# EAGLE design uhf.indication.v2 (EAGLE 6.5.0)
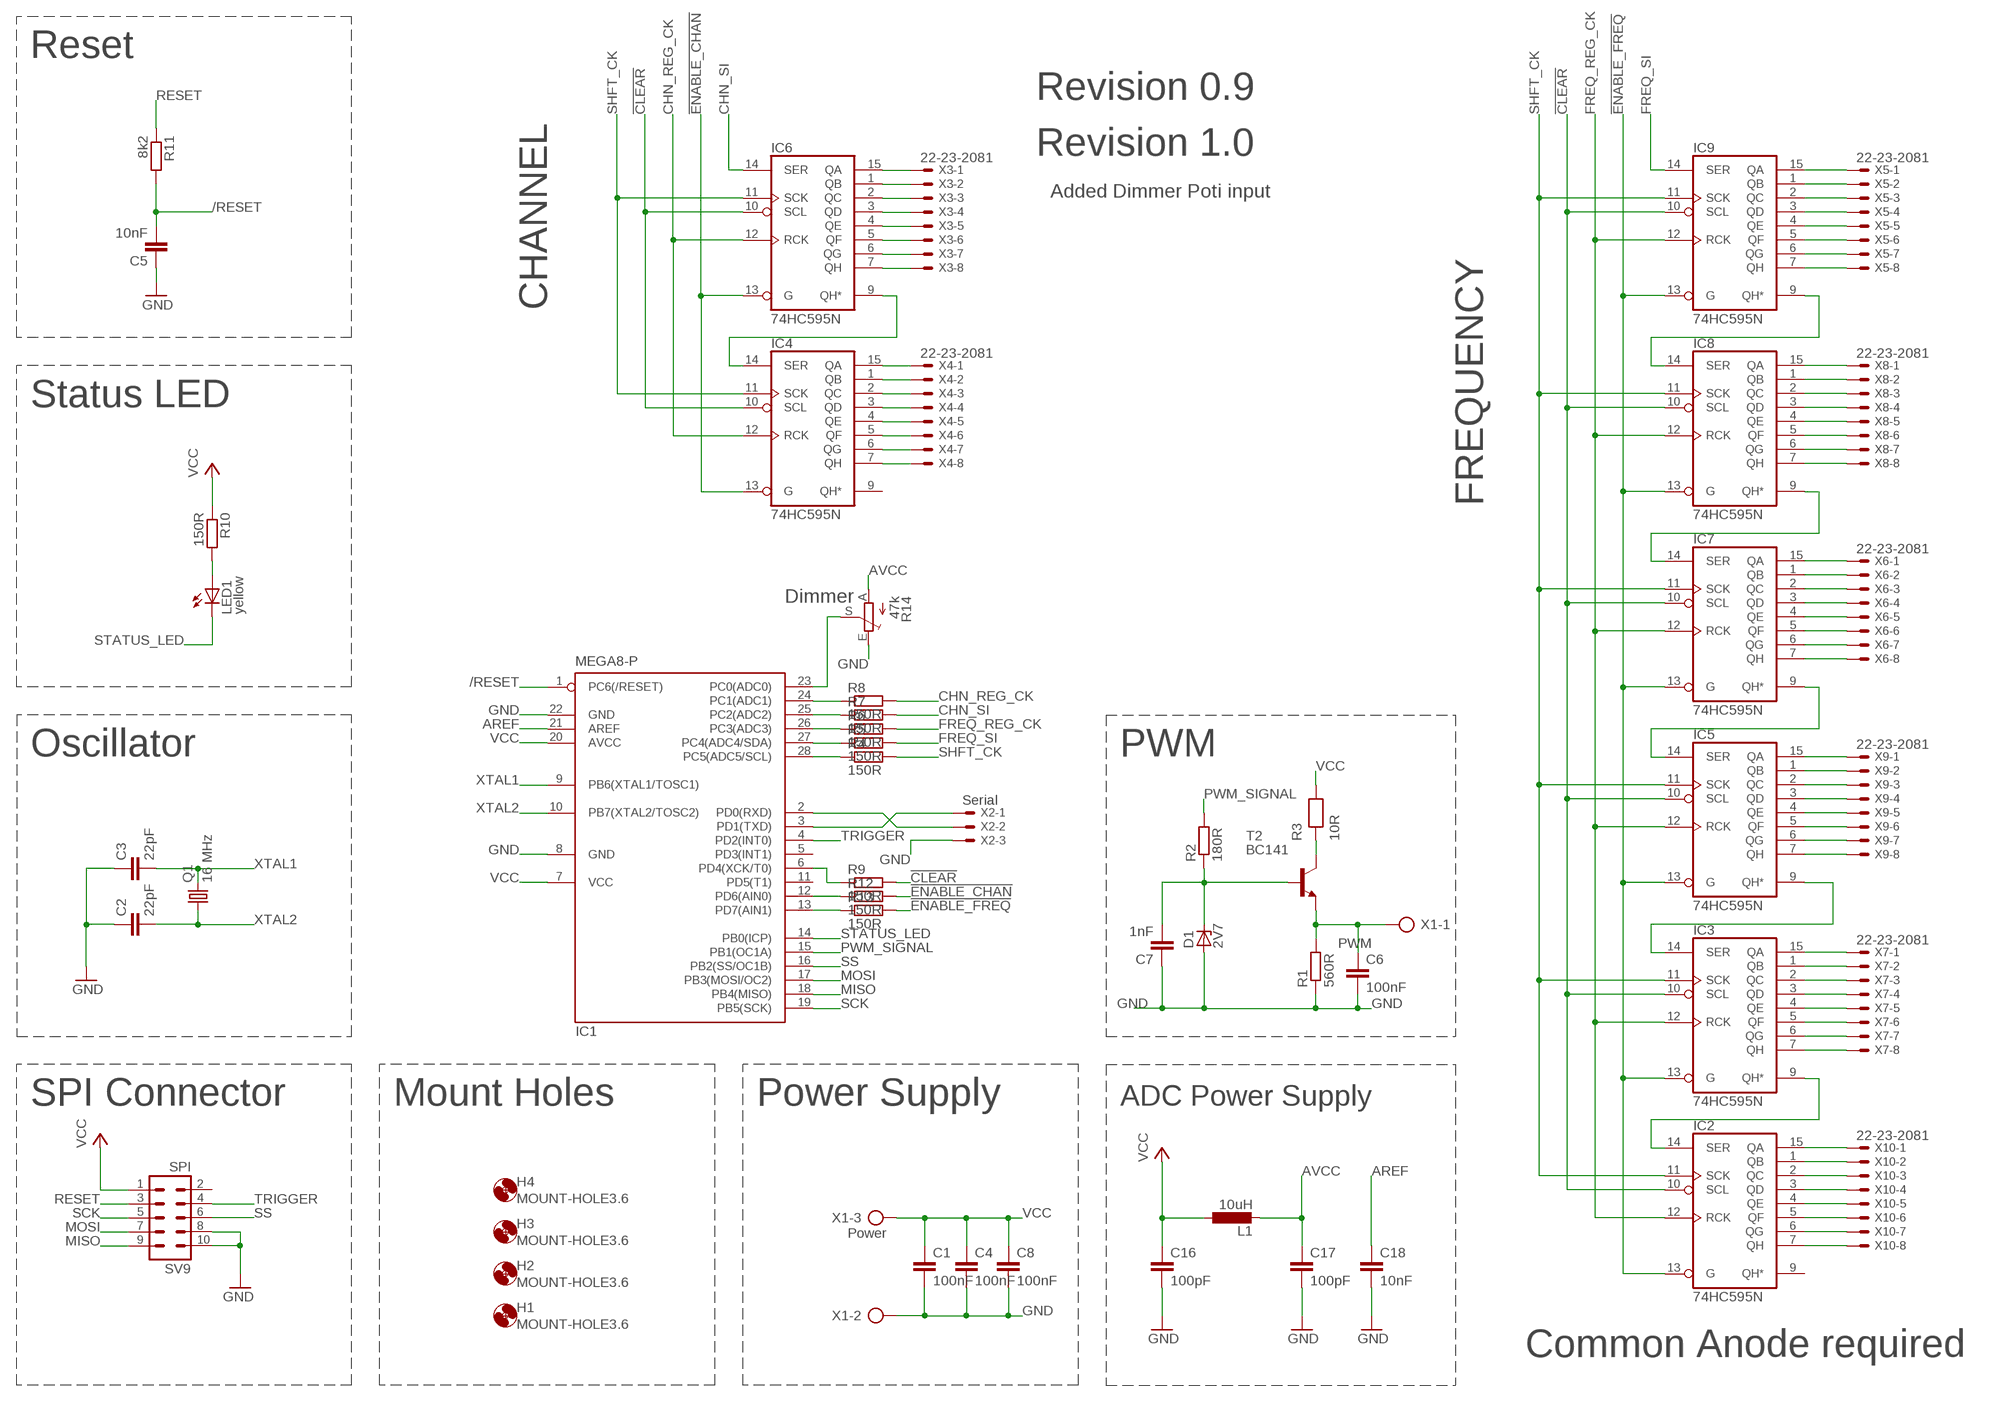
[diagram p0: schematic, sheet 1]

## Parts
C1  100nF  C-EU050-024X044  [C050-024X044]
C2  22pF  C-EU025-025X050  [C025-025X050]
C3  22pF  C-EU025-025X050  [C025-025X050]
C4  100nF  C-EU050-024X044  [C050-024X044]
C5  10nF  C-EU025-025X050  [C025-025X050]
C6  100nF  C-EU050-024X044  [C050-024X044]
C7  1nF  C-EU025-025X050  [C025-025X050]
C8  100nF  C-EU050-024X044  [C050-024X044]
C16  100pF  C-EU025-025X050  [C025-025X050]
C17  100pF  C-EU025-025X050  [C025-025X050]
C18  10nF  C-EU025-025X050  [C025-025X050]
D1  2V7  ZENER-DIODEZD-10  [ZDIO-10]
H1  MOUNT-HOLE3.6  [3,6]
H2  MOUNT-HOLE3.6  [3,6]
H3  MOUNT-HOLE3.6  [3,6]
H4  MOUNT-HOLE3.6  [3,6]
IC1  MEGA8-P  [DIL28-3]
IC2  74HC595N  [DIL16]
IC3  74HC595N  [DIL16]
IC4  74HC595N  [DIL16]
IC5  74HC595N  [DIL16]
IC6  74HC595N  [DIL16]
IC7  74HC595N  [DIL16]
IC8  74HC595N  [DIL16]
IC9  74HC595N  [DIL16]
L1  10uH  L-EU2200-15.24  [2200-15.24]
LED1  yellow  LEDCHIPLED_1206  [CHIPLED_1206]
Q1  16 MHz  CRYSTALHC18U-V  [HC18U-V]
R1  560R  R-EU_0207/2V  [0207/2V@1]
R2  180R  R-EU_0207/2V  [0207/2V@1]
R3  10R  RESISTOR  [208-08]
R4  150R  R-EU_R0805  [R0805]
R5  150R  R-EU_R0805  [R0805]
R6  150R  R-EU_R0805  [R0805]
R7  150R  R-EU_R0805  [R0805]
R8  150R  R-EU_R0805  [R0805]
R9  150R  R-EU_R0805  [R0805]
R10  150R  R-EU_R0805  [R0805]
R11  8k2  R-EU_M0805  [M0805]
R12  150R  R-EU_R0805  [R0805]
R13  150R  R-EU_R0805  [R0805]
R14  47k  TRIM_EU-B25V  [B25V]
SV9  SPI  ML10  [ML10]
T2  BC141  BC141-16-NPN-TO39-EBC  [TO39]
X1  Power  AK500/3  [AK500/3]
X2  Serial  22-23-2031  [22-23-2031]
X3  22-23-2081  [22-23-2081]
X4  22-23-2081  [22-23-2081]
X5  22-23-2081  [22-23-2081]
X6  22-23-2081  [22-23-2081]
X7  22-23-2081  [22-23-2081]
X8  22-23-2081  [22-23-2081]
X9  22-23-2081  [22-23-2081]
X10  22-23-2081  [22-23-2081]

## Nets
!CLEAR: IC2.10(SCL) IC3.10(SCL) IC4.10(SCL) IC5.10(SCL) IC6.10(SCL) IC7.10(SCL) IC8.10(SCL) IC9.10(SCL) R9.2
!ENABLE_CHAN: IC4.13(G) IC6.13(G) R12.2
!ENABLE_FREQ: IC2.13(G) IC3.13(G) IC5.13(G) IC7.13(G) IC8.13(G) IC9.13(G) R13.2
/RESET: C5.2 IC1.1(PC6(/RESET)) R11.2
AREF: C18.1 IC1.21(AREF)
AVCC: C17.1 L1.2 R14.A
CHN_REG_CK: IC4.12(RCK) IC6.12(RCK) R8.2
CHN_SI: IC6.14(SER) R7.2
FREQ_REG_CK: IC2.12(RCK) IC3.12(RCK) IC5.12(RCK) IC7.12(RCK) IC8.12(RCK) IC9.12(RCK) R6.2
FREQ_SI: IC9.14(SER) R5.2
GND: C1.2 C2.1 C3.1 C4.2 C5.1 C6.2 C7.1 C8.2 C16.2 C17.2 C18.2 D1.A IC1.8(GND) IC1.22(GND) R1.1 R14.E SV9.8 SV9.10 X1.2 X2.3
MISO: IC1.18(PB4(MISO)) SV9.9
MOSI: IC1.17(PB3(MOSI/OC2)) SV9.7
N$1: IC1.28(PC5(ADC5/SCL)) R4.1
N$2: IC1.6(PD4(XCK/T0)) R9.1
N$3: IC4.14(SER) IC6.9(QH*)
N$4: IC6.15(QA) X3.1
N$5: IC1.24(PC1(ADC1)) R8.1
N$6: IC1.25(PC2(ADC2)) R7.1
N$7: IC8.14(SER) IC9.9(QH*)
N$8: IC7.14(SER) IC8.9(QH*)
N$9: IC5.14(SER) IC7.9(QH*)
N$10: IC3.14(SER) IC5.9(QH*)
N$11: IC2.14(SER) IC3.9(QH*)
N$12: IC6.1(QB) X3.2
N$13: IC6.2(QC) X3.3
N$14: IC6.3(QD) X3.4
N$15: IC6.4(QE) X3.5
N$16: IC6.5(QF) X3.6
N$17: IC6.6(QG) X3.7
N$18: IC6.7(QH) X3.8
N$19: IC4.15(QA) X4.1
N$20: IC4.1(QB) X4.2
N$21: IC4.2(QC) X4.3
N$22: IC4.3(QD) X4.4
N$23: IC4.4(QE) X4.5
N$24: IC4.5(QF) X4.6
N$25: IC4.6(QG) X4.7
N$26: IC4.7(QH) X4.8
N$27: IC9.15(QA) X5.1
N$28: IC9.1(QB) X5.2
N$29: IC9.2(QC) X5.3
N$30: IC9.3(QD) X5.4
N$31: IC9.4(QE) X5.5
N$32: IC1.26(PC3(ADC3)) R6.1
N$33: IC1.27(PC4(ADC4/SDA)) R5.1
N$35: IC9.5(QF) X5.6
N$36: IC9.6(QG) X5.7
N$37: C7.2 D1.C R2.1 T2.2(B)
N$38: R3.P$2 T2.3(C)
N$39: IC1.13(PD7(AIN1)) R13.1
N$40: IC1.12(PD6(AIN0)) R12.1
N$41: IC1.23(PC0(ADC0)) R14.S
N$45: IC9.7(QH) X5.8
N$46: IC8.15(QA) X8.1
N$47: LED1.A R10.2
N$48: IC8.1(QB) X8.2
N$49: IC8.2(QC) X8.3
N$50: IC8.3(QD) X8.4
N$51: IC8.4(QE) X8.5
N$52: IC8.5(QF) X8.6
N$53: IC8.6(QG) X8.7
N$54: IC8.7(QH) X8.8
N$55: IC7.15(QA) X6.1
N$56: IC7.1(QB) X6.2
N$57: IC7.2(QC) X6.3
N$58: IC7.3(QD) X6.4
N$59: IC7.4(QE) X6.5
N$60: IC7.5(QF) X6.6
N$61: IC7.6(QG) X6.7
N$62: IC7.7(QH) X6.8
N$63: IC5.15(QA) X9.1
N$64: IC5.1(QB) X9.2
N$65: IC5.2(QC) X9.3
N$66: IC5.3(QD) X9.4
N$67: IC5.4(QE) X9.5
N$68: IC5.5(QF) X9.6
N$69: IC5.6(QG) X9.7
N$70: IC5.7(QH) X9.8
N$71: IC3.15(QA) X7.1
N$72: IC3.1(QB) X7.2
N$73: IC3.2(QC) X7.3
N$74: IC3.3(QD) X7.4
N$75: IC3.4(QE) X7.5
N$76: IC3.5(QF) X7.6
N$77: IC3.6(QG) X7.7
N$78: IC3.7(QH) X7.8
N$79: IC2.15(QA) X10.1
N$80: IC2.1(QB) X10.2
N$81: IC2.2(QC) X10.3
N$82: IC2.3(QD) X10.4
N$83: IC2.4(QE) X10.5
N$84: IC2.5(QF) X10.6
N$85: IC2.6(QG) X10.7
N$86: IC2.7(QH) X10.8
PWM: C6.1 R1.2 T2.1(E) X1.1
PWM_SIGNAL: IC1.15(PB1(OC1A)) R2.2
RESET: R11.1 SV9.3
RX: IC1.2(PD0(RXD)) X2.2
SCK: IC1.19(PB5(SCK)) SV9.5
SHFT_CK: IC2.11(SCK) IC3.11(SCK) IC4.11(SCK) IC5.11(SCK) IC6.11(SCK) IC7.11(SCK) IC8.11(SCK) IC9.11(SCK) R4.2
SS: IC1.16(PB2(SS/OC1B)) SV9.6
STATUS_LED: IC1.14(PB0(ICP)) LED1.C
TRIGGER: IC1.4(PD2(INT0)) SV9.4
TX: IC1.3(PD1(TXD)) X2.1
VCC: C1.1 C4.1 C8.1 C16.1 IC1.7(VCC) IC1.20(AVCC) L1.1 R3.P$1 R10.1 SV9.1 X1.3
XTAL1: C3.2 IC1.9(PB6(XTAL1/TOSC1)) Q1.2
XTAL2: C2.2 IC1.10(PB7(XTAL2/TOSC2)) Q1.1
Unconnected: IC1.5(PD3(INT1)) IC1.11(PD5(T1)) IC2.9(QH*) IC4.9(QH*) SV9.2

## Notes on the sheet
- Reset
- Revision 0.9
- Revision 1.0
- Added Dimmer Poti input
- CHANNEL
- Status LED
- FREQUENCY
- Dimmer
- Oscillator | PWM
- SPI Connector | Mount Holes | Power Supply | ADC Power Supply
- Common Anode required

## Power pins joined to a net without a drawn wire
GND: IC2.8(GND) IC3.8(GND) IC4.8(GND) IC5.8(GND) IC6.8(GND) IC7.8(GND) IC8.8(GND) IC9.8(GND)
VCC: IC2.16(VCC) IC3.16(VCC) IC4.16(VCC) IC5.16(VCC) IC6.16(VCC) IC7.16(VCC) IC8.16(VCC) IC9.16(VCC)

## Library data of the parts
C1-C8 C16-C18 = rcl:C-EU: CAPACITOR, European symbol
D1 = diode:ZENER-DIODE: Z-Diode
H1-H4 = holes:MOUNT-HOLE: MOUNTING HOLE with drill center marker
IC1 = atmel:MEGA8-P: MICROCONTROLLER 8 Kbytes FLASH, 1 kbytes SRAM, 512 bytes EEPROM, USART, 4-channel 10 bit ADC, 2-channel 8 bit ADC Pin compatible with Atmega48, ATMega88, ATMega168 Source: avr.lbr
IC2-IC9 = 74xx-eu:74*595: 8-bit SHIFT REGISTER, output latch
L1 = rcl:L-EU: INDUCTOR, European symbol
LED1 = led:LED: LED OSRAM: - CHIPLED LG R971, LG N971, LY N971, LG Q971, LY Q971, LO R971, LY R971 LH N974, LH R974 LS Q976, LO Q976, LY Q976 LO Q996 - Hyper CHIPLED LW Q18S LB Q993, LB Q99A, LB R99A - SideLED LS A670, LO A670, LY A670, LG A670, LP A670 LB A673, LV A673, LT A673, LW A673 LH A674 LY A675 LS A676, LA A676, LO A676, LY A676, LW A676 LS A679, LY A679, LG A679 - Hyper Micro SIDELED® LS Y876, LA Y876, LO Y876, LY Y876 LT Y87S - SmartLED LW L88C, LW L88S LB L89C, LB L89S, LG L890 LS L89K, LO L89K, LY L89K LS L896, LA L896, LO L896, LY L896 - TOPLED LS T670, LO T670, LY T670, LG T670, LP T670 LSG T670, LSP T670, LSY T670, LOP T670, LYG T670 LG T671, LOG T671, LSG T671 LB T673, LV T673, LT T673, LW T673 LH T674 LS T676, LA T676, LO T676, LY T676, LB T676, LH T676, LSB T676, LW T676 LB T67C, LV T67C, LT T67C, LS T67K, LO T67K, LY T67K, LW E67C LS E67B, LA E67B, LO E67B, LY E67B, LB E67C, LV E67C, LT E67C LW T67C LS T679, LY T679, LG T679 LS T770, LO T770, LY T770, LG T770, LP T770 LB T773, LV T773, LT T773, LW T773 LH T774 LS E675, LA E675, LY E675, LS T675 LS T776, LA T776, LO T776, LY T776, LB T776 LHGB T686 LT T68C, LB T68C - Hyper Mini TOPLED® LB M676 - Mini TOPLED Santana® LG M470 LS M47K, LO M47K, LY M47K Source: http://www.osram.convergy.de - LUMILED® LXK2-PW12-R00, LXK2-PW12-S00, LXK2-PW14-U00, LXK2-PW14-V00 LXK2-PM12-R00, LXK2-PM12-S00, LXK2-PM14-U00 LXK2-PE12-Q00, LXK2-PE12-R00, LXK2-PE12-S00, LXK2-PE14-T00, LXK2-PE14-U00 LXK2-PB12-K00, LXK2-PB12-L00, LXK2-PB12-M00, LXK2-PB14-N00, LXK2-PB14-P00, LXK2-PB14-Q00 LXK2-PR12-L00, LXK2-PR12-M00, LXK2-PR14-Q00, LXK2-PR14-R00 LXK2-PD12-Q00, LXK2-PD12-R00, LXK2-PD12-S00 LXK2-PH12-R00, LXK2-PH12-S00 LXK2-PL12-P00, LXK2-PL12-Q00, LXK2-PL12-R00 Source: www.luxeon.com
Q1 = crystal:CRYSTAL: CRYSTAL
R1 R2 R4-R13 = rcl:R-EU_: RESISTOR, European symbol
R3 = resistor:RESISTOR
R14 = pot:TRIM_EU-: POTENTIOMETER
SV9 = con-ml:ML10: HARTING
T2 = transistor:*-NPN-: NPN Transistror BF959 corrected 2008.03.06
X1 = con-ptr500:AK500/3: CONNECTOR
X2 = con-molex:22-23-2031: .100" (2.54mm) Center Header - 3 Pin
X3-X10 = con-molex:22-23-2081: .100" (2.54mm) Center Header - 8 Pin

## Board
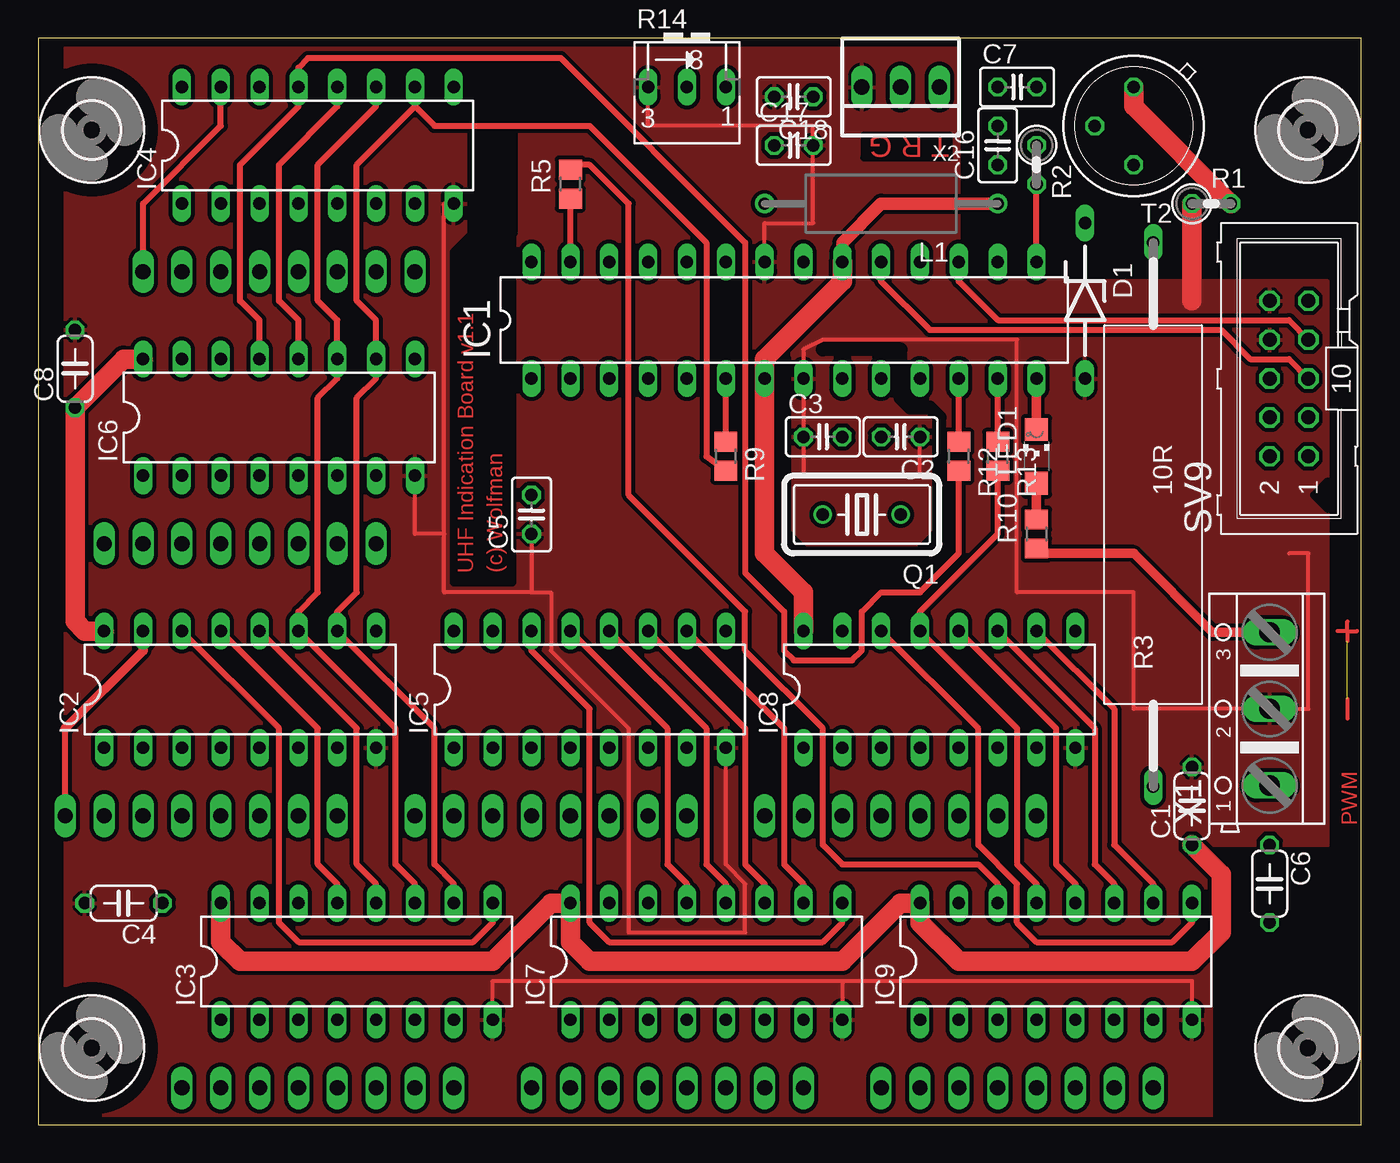
[diagram p1: board, top side]
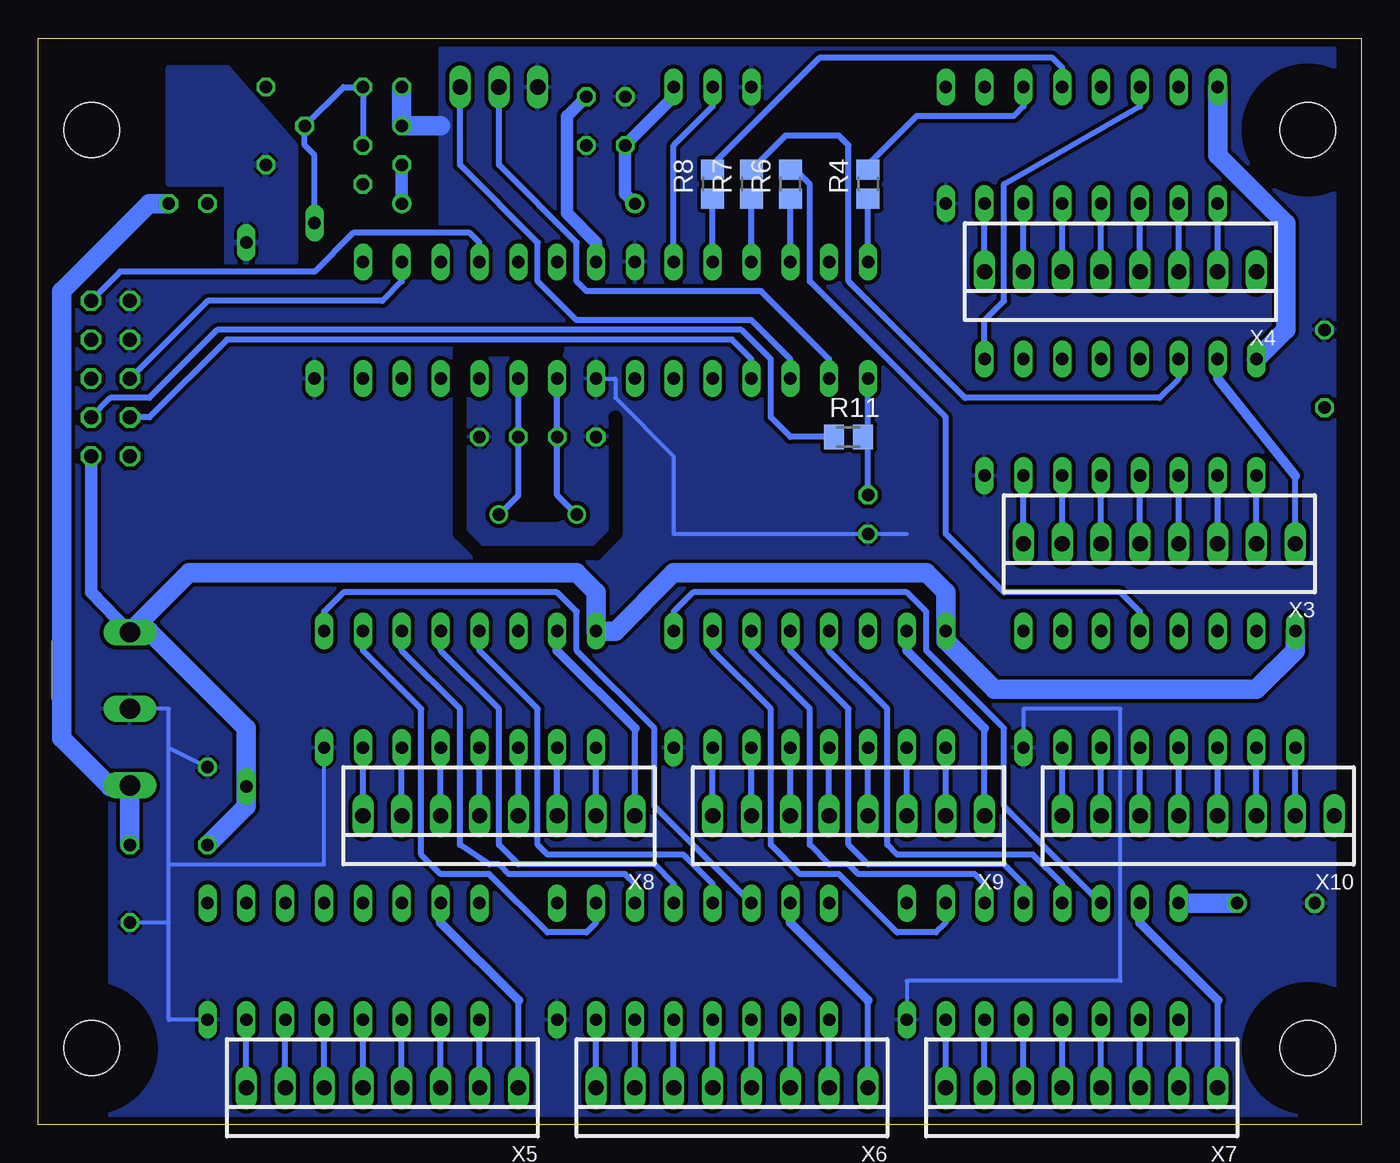
[diagram p2: board, bottom side, seen from below]

Size 86.5 x 71 mm. Coordinates in mm from the lower left corner, seen from the top.
Outline: 0,0 86.5,0 86.5,71 0,71 0,0
Copper layers (1*16): Top 0.035mm / dielectric 1.5mm / Bottom 0.035mm
Design rules "PCB-POOL *": minimum track width 6mil, minimum drill 12mil, track to track 6mil, track to pad 6mil, pad to pad 6mil, via to via 6mil, smd to smd 6mil, copper to edge 20mil, drill to drill 8mil, minimum pad ring 8mil, minimum via ring 6mil, stop-mask expansion 3mil, vias tented up to drill 0mil, thermal gap 8mil
tRestrict: area 83.4,40.2 to 85.2,42; 16 lines
bRestrict: 7 lines

### Footprints (pad centres in the part's own frame; a part is rotated, then mirrored left to right if it is on the bottom)
C050-024X044 = drill 0.813 octagon: 1 -2.54,0; 2 2.54,0
C025-025X050 = drill 0.813 octagon: 1 -1.27,0; 2 1.27,0
ZDIO-10 = drill 0.813 long: A 5.08,0; C -5.08,0
3,6 = hole 3.6: 0,0
DIL28-3 = drill 0.813 long: 1 -16.51,-3.81; 2 -13.97,-3.81; 3 -11.43,-3.81; 4 -8.89,-3.81; 5 -6.35,-3.81; 6 -3.81,-3.81; 7 -1.27,-3.81; 8 1.27,-3.81; 9 3.81,-3.81; 10 6.35,-3.81; 11 8.89,-3.81; 12 11.43,-3.81; 13 13.97,-3.81; 14 16.51,-3.81; 15 16.51,3.81; 16 13.97,3.81; 17 11.43,3.81; 18 8.89,3.81; 19 6.35,3.81; 20 3.81,3.81; 21 1.27,3.81; 22 -1.27,3.81; 23 -3.81,3.81; 24 -6.35,3.81; 25 -8.89,3.81; 26 -11.43,3.81; 27 -13.97,3.81; 28 -16.51,3.81
DIL16 = drill 0.813 long: 1 -8.89,-3.81; 2 -6.35,-3.81; 3 -3.81,-3.81; 4 -1.27,-3.81; 5 1.27,-3.81; 6 3.81,-3.81; 7 6.35,-3.81; 8 8.89,-3.81; 9 8.89,3.81; 10 6.35,3.81; 11 3.81,3.81; 12 1.27,3.81; 13 -1.27,3.81; 14 -3.81,3.81; 15 -6.35,3.81; 16 -8.89,3.81
2200-15.24 = drill 0.8 pad 1.27: 1 -7.62,0; 2 7.62,0
CHIPLED_1206 = smd 1.5 x 1.5: A 0,-1.75; C 0,1.75
HC18U-V = drill 0.813: 1 -2.54,0; 2 2.54,0
0207/2V@1 = drill 0.813 octagon: 1 -1.27,0; 2 1.27,0
208-08 = drill 0.8 long: P$1 -17.78,0; P$2 17.78,0
R0805 = smd 1.3 x 1.5: 1 -0.95,0; 2 0.95,0
M0805 = smd 1.3 x 1.6: 1 -0.95,0; 2 0.95,0
B25V = drill 0.813 long: A 2.54,0.635; E -2.54,0.635; S 0,0.635
ML10 = drill 0.914 octagon: 1 -5.08,-1.27; 2 -5.08,1.27; 3 -2.54,-1.27; 4 -2.54,1.27; 5 0,-1.27; 6 0,1.27; 7 2.54,-1.27; 8 2.54,1.27; 9 5.08,-1.27; 10 5.08,1.27
TO39 = drill 0.813 octagon: 1 0,-2.54; 2 2.54,0; 3 0,2.54
AK500/3 = drill 1.321 long: 1 -5.004,0; 2 0,0; 3 5.004,0
22-23-2031 = drill 1 long: 1 -2.54,0; 2 0,0; 3 2.54,0
22-23-2081 = drill 1 long: 1 -8.89,0; 2 -6.35,0; 3 -3.81,0; 4 -1.27,0; 5 1.27,0; 6 3.81,0; 7 6.35,0; 8 8.89,0

### Placement (x,y rotation side)
C1  75.43,20.82 90 top
C2  56.38,44.95 180 top
C3  51.3,44.95 0 top
C4  5.58,14.47 180 top
C5  32.25,39.87 90 top
C6  80.51,15.74 270 top
C7  64,67.81 0 top
C8  2.41,49.4 90 top
C16  62.73,64 90 top
C17  49.4,64 0 top
C18  49.4,67.17 180 top
D1  68.44,53.84 270 top
H1  3.5,5 0 top
H2  83,5 0 top
H3  3.5,65 0 top
H4  83,65 0 top
IC1  48.76,52.57 0 top
IC2  13.2,28.44 0 top
IC3  20.82,10.66 0 top
IC4  18.28,64 0 top
IC5  36.06,28.44 0 top
IC6  15.74,46.22 0 top
IC7  43.68,10.66 0 top
IC8  58.92,28.44 0 top
IC9  66.54,10.66 0 top
L1  55.11,60.19 180 top
LED1  65.27,43.68 0 top
Q1  53.84,39.87 180 top
R1  76.7,60.19 0 top
R2  65.27,62.73 270 top
R3  72.89,39.87 90 top
R4  32.25,61.46 90 bottom
R5  34.79,61.46 90 top
R6  37.33,61.46 90 bottom
R7  39.87,61.46 90 bottom
R8  42.41,61.46 90 bottom
R9  44.95,43.68 270 top
R10  65.27,38.6 90 top
R11  33.52,44.95 0 bottom
R12  60.19,43.68 270 top
R13  62.73,43.68 270 top
R14  42.41,67.17 0 top
SV9  81.78,48.76 90 top
T2  71.62,65.27 180 top
X1  80.51,27.17 90 top
X2  56.38,67.81 180 top
X3  13.2,37.97 180 bottom
X4  15.74,55.74 180 bottom
X5  64,2.41 180 bottom
X6  41.14,2.41 180 bottom
X7  18.28,2.41 180 bottom
X8  56.38,20.18 180 bottom
X9  33.52,20.18 180 bottom
X10  10.66,20.18 180 bottom

### Tracks (layer width: path | path; a pad name or v marks a point on that pad's centre or on a via)
!CLEAR
  Top 0.406: R9.2 43.68,43.68 43.68,57.65 36.06,65.27 25.9,65.27 24.63,66.54 | 24.63,66.54 20.82,62.73 20.82,53.84 22.09,52.57 IC6.10 22.09,48.76 20.82,47.49 20.82,34.79 19.55,33.52 IC2.10 25.9,25.9 25.9,17.01 27.17,15.74 IC3.10 | 24.63,66.54 IC4.10 | IC5.10 48.76,25.9 48.76,17.01 50.03,15.74 IC7.10 | IC8.10 70.35,27.17 70.35,18.28 72.89,15.74 IC9.10
  Bottom 0.406: IC5.10 42.41,30.98 38.6,27.17 38.6,18.28 36.7,16.38 34.16,16.38 30.34,12.56 27.8,12.56 27.17,13.2 IC3.10 | IC7.10 50.03,13.2 50.66,12.56 53.2,12.56 57.02,16.38 60.19,16.38 61.46,17.64 61.46,27.17 65.27,30.98 IC8.10
!ENABLE_CHAN
  Top 0.406: IC6.13 14.47,52.57 13.2,53.84 13.2,62.73 17.01,66.54 IC4.13 17.01,69.08 17.64,69.72 34.16,69.72 46.22,57.65 46.22,36.06 48.76,33.52 48.76,30.98 49.4,30.34 53.2,30.34 53.84,30.98 53.84,33.52 55.11,34.79 57.65,34.79 60.19,37.33 R12.2
!ENABLE_FREQ
  Top 0.406: IC2.13 18.28,25.9 18.28,17.01 19.55,15.74 IC3.13 | IC5.13 41.14,25.9 41.14,17.01 42.41,15.74 IC7.13 | IC9.13 65.27,15.74 64,17.01 64,25.9 IC8.13 57.65,33.52 62.73,38.6 R13.2
  Bottom 0.406: IC3.13 19.55,15.74 21.45,17.64 30.34,17.64 30.98,18.28 30.98,27.17 34.79,30.98 IC5.13 | IC7.13 42.41,15.74 44.31,17.64 53.2,17.64 53.84,18.28 53.84,27.17 57.65,30.98 IC8.13
/RESET
  Bottom 0.406: 32.25,44.95 IC1.1 | C5.2 32.25,44.95 | 32.25,44.95 R11.2
AREF
  Bottom 0.813: IC1.21 50.03,57.65 51.94,59.55 51.94,65.91 C18.1
AVCC
  Bottom 0.813: L1.2 48.12,60.83 C17.1 44.95,67.17 R14.A
CHN_REG_CK
  Top 0.406: IC4.12 19.55,66.54 15.74,62.73 15.74,53.84 17.01,52.57 IC6.12
  Bottom 0.406: R8.2 42.41,62.73 35.42,69.72 20.18,69.72 19.55,69.08 IC4.12
CHN_SI
  Bottom 0.406: R7.2 37.65,64.64 34.16,64.64 33.52,64 33.52,55.11 25.9,47.49 13.2,47.49 11.93,48.76 IC6.14
FREQ_REG_CK
  Top 0.406: IC2.12 20.82,25.9 20.82,17.01 22.09,15.74 IC3.12 | IC5.12 43.68,25.9 43.68,17.01 44.95,15.74 IC7.12 | IC8.12 66.54,25.9 66.54,17.01 67.81,15.74 IC9.12
  Bottom 0.406: IC3.12 22.09,15.74 23.36,17.01 32.25,17.01 33.52,18.28 33.52,27.17 37.33,30.98 IC5.12 | IC7.12 44.95,15.74 46.22,17.01 55.11,17.01 56.38,18.28 56.38,27.17 60.19,30.98 IC8.12 | R6.2 37.33,62.73 36.06,61.46 36.06,55.11 27.17,46.22 27.17,38.6 23.36,34.79 15.74,34.79 14.47,33.52 IC2.12
FREQ_SI
  Top 0.406: R5.2 34.79,62.73 36.06,62.73 38.6,60.19 38.6,41.14 46.22,33.52 46.22,30.98 51.3,25.9 51.3,18.28 52.57,17.01 61.46,17.01 62.73,15.74 IC9.14
GND
  Top 0.254: C2.1 57.65,42.41 50.03,42.41 C3.1 IC1.8 50.03,50.66 51.3,51.3 64,51.3 64,34.79 71.62,34.79 71.62,27.17 X1.2 83.05,27.17 83.05,37.33 81.78,37.33 | 26.54,38.6 24.63,38.6 IC6.8 | 32.25,34.79 26.54,34.79 26.54,38.6 | 52.57,9.39 IC7.8 | 52.57,9.39 75.43,9.39 IC9.8 | IC3.8 29.71,9.39 52.57,9.39 | 26.54,38.6 26.54,60.19 IC4.8 | IC5.8 44.95,17.01 46.22,15.74 46.22,12.56 38.6,12.56 38.6,25.9 33.52,30.98 33.52,34.79 32.25,34.79 | C5.1 32.25,34.79 | R14.E 39.87,65.27 50.66,65.27 C17.2 50.66,58.92 47.49,58.92 IC1.22
  Top 1.27: 75.43,53.84 R1.1
  Bottom 0.254: IC8.8 67.81,17.01 77.97,17.01 | 29.71,38.6 C5.1 44.95,38.6 44.95,43.68 48.76,47.49 48.76,48.76 IC1.8 | IC2.8 22.09,27.17 15.74,27.17 15.74,9.39 29.71,9.39 IC3.8 | IC9.8 77.97,6.85 77.97,13.2 | 77.97,13.2 77.97,17.01 | 77.97,17.01 77.97,24.63 | 77.97,24.63 77.97,27.17 X1.2 | 77.97,13.2 C6.2 | 77.97,24.63 C1.2
  Bottom 1.27: C7.1 C16.2 60.19,65.27
  pour Bottom (isolate 0.254): 1.77,70.35 1.77,0.5 81.78,0.5 81.78,22.09 86.86,22.09 86.86,55.11 60.19,55.11 60.19,70.35
  pour Top (isolate 0.254): 1.77,70.35 1.77,0.5 76.7,0.5 76.7,18.28 84.32,18.28 84.32,55.11 60.19,55.11 60.19,70.35
MISO
  Bottom 0.406: IC1.18 57.65,57.65 58.28,58.28 65.91,58.28 68.44,55.74 81.14,55.74 SV9.9
MOSI
  Top 0.406: IC1.17 60.19,55.11 62.73,52.57 81.78,52.57 SV9.7
N$1
  Bottom 0.406: IC1.28 R4.1
N$2
  Top 0.406: R9.1 IC1.6
N$3
  Bottom 0.406: IC4.14 14.47,66.54 23.36,61.46 23.36,53.84 24.63,52.57 IC6.9
N$4
  Bottom 0.406: X3.1 4.31,42.41
  Bottom 0.61: IC6.15 9.39,48.76 4.31,42.41
N$5
  Bottom 0.406: IC1.24 R8.1
N$6
  Bottom 0.406: IC1.25 R7.1
N$7
  Top 0.406: IC8.14 61.46,25.9 61.46,18.28 64,15.74 64,13.2 65.27,11.93 74.16,11.93 75.43,13.2 IC9.9
N$8
  Bottom 0.406: IC7.14 46.22,20.82 46.22,25.9 51.3,30.98 51.3,33.52 52.57,34.79 66.54,34.79 67.81,33.52 IC8.9
N$9
  Top 0.406: IC5.14 32.25,30.98 36.06,27.17 36.06,13.2 37.33,11.93 51.3,11.93 52.57,13.2 IC7.9
N$10
  Bottom 0.406: IC5.9 44.95,33.52 43.68,34.79 29.71,34.79 28.44,33.52 28.44,30.98 23.36,25.9 23.36,20.82 IC3.14
N$11
  Top 0.406: IC2.14 15.74,25.9 15.74,13.2 17.01,11.93 28.44,11.93 29.71,13.2 IC3.9
N$12
  Bottom 0.406: X3.2 IC6.1
N$13
  Bottom 0.406: X3.3 IC6.2
N$14
  Bottom 0.406: X3.4 IC6.3
N$15
  Bottom 0.406: X3.5 IC6.4
N$16
  Bottom 0.406: X3.6 IC6.5
N$17
  Bottom 0.406: X3.7 IC6.6
N$18
  Bottom 0.406: X3.8 IC6.7
N$19
  Top 0.406: IC4.15 11.93,65.27 6.85,60.19 X4.1
N$20
  Bottom 0.406: X4.2 IC4.1
N$21
  Bottom 0.406: X4.3 IC4.2
N$22
  Bottom 0.406: X4.4 IC4.3
N$23
  Bottom 0.406: X4.5 IC4.4
N$24
  Bottom 0.406: X4.6 IC4.5
N$25
  Bottom 0.406: X4.7 IC4.6
N$26
  Bottom 0.406: X4.8 IC4.7
N$27
  Bottom 0.406: X5.1 55.11,8.12
  Bottom 0.61: IC9.15 60.19,13.2 55.11,8.12
N$28
  Bottom 0.406: X5.2 IC9.1
N$29
  Bottom 0.406: X5.3 IC9.2
N$30
  Bottom 0.406: X5.4 IC9.3
N$31
  Bottom 0.406: X5.5 IC9.4
N$32
  Bottom 0.406: IC1.26 R6.1
N$33
  Top 0.406: IC1.27 R5.1
N$35
  Bottom 0.406: X5.6 IC9.5
N$36
  Bottom 0.406: X5.7 IC9.6
N$37
  Bottom 0.406: R2.1 C7.2 66.54,67.81 T2.2 69.08,64 68.44,63.37 D1.C
N$38
  pour Bottom: 69.72,64 69.72,56.38 74.16,56.38 74.16,61.46 77.97,61.46 77.97,69.08 74.16,69.08
N$39
  Top 0.406: R13.1 IC1.13
N$40
  Top 0.406: R12.1 IC1.12
N$41
  Bottom 0.406: R14.S 42.41,66.54 44.95,64 IC1.23
N$45
  Bottom 0.406: X5.8 IC9.7
N$46
  Bottom 0.406: X8.1 47.49,25.9
  Bottom 0.61: IC8.15 52.57,30.98 47.49,25.9
N$47
  Top 0.61: R10.2 LED1.A
N$48
  Bottom 0.406: X8.2 IC8.1
N$49
  Bottom 0.406: X8.3 IC8.2
N$50
  Bottom 0.406: X8.4 IC8.3
N$51
  Bottom 0.406: X8.5 IC8.4
N$52
  Bottom 0.406: X8.6 IC8.5
N$53
  Bottom 0.406: X8.7 IC8.6
N$54
  Bottom 0.406: X8.8 IC8.7
N$55
  Bottom 0.406: X6.1 32.25,8.12
  Bottom 0.61: IC7.15 37.33,13.2 32.25,8.12
N$56
  Bottom 0.406: X6.2 IC7.1
N$57
  Bottom 0.406: X6.3 IC7.2
N$58
  Bottom 0.406: X6.4 IC7.3
N$59
  Bottom 0.406: X6.5 IC7.4
N$60
  Bottom 0.406: X6.6 IC7.5
N$61
  Bottom 0.406: X6.7 IC7.6
N$62
  Bottom 0.406: X6.8 IC7.7
N$63
  Bottom 0.406: X9.1 24.63,25.9
  Bottom 0.61: IC5.15 29.71,30.98 24.63,25.9
N$64
  Bottom 0.406: X9.2 IC5.1
N$65
  Bottom 0.406: X9.3 IC5.2
N$66
  Bottom 0.406: X9.4 IC5.3
N$67
  Bottom 0.406: X9.5 IC5.4
N$68
  Bottom 0.406: X9.6 IC5.5
N$69
  Bottom 0.406: X9.7 IC5.6
N$70
  Bottom 0.406: X9.8 IC5.7
N$71
  Bottom 0.406: X7.1 9.39,8.12
  Bottom 0.61: IC3.15 14.47,13.2 9.39,8.12
N$72
  Bottom 0.406: X7.2 IC3.1
N$73
  Bottom 0.406: X7.3 IC3.2
N$74
  Bottom 0.406: X7.4 IC3.3
N$75
  Bottom 0.406: X7.5 IC3.4
N$76
  Bottom 0.406: X7.6 IC3.5
N$77
  Bottom 0.406: X7.7 IC3.6
N$78
  Bottom 0.406: X7.8 IC3.7
N$79
  Top 0.406: X10.1 1.77,25.9
  Top 0.61: IC2.15 6.85,30.98 1.77,25.9
N$80
  Bottom 0.406: X10.2 IC2.1
N$81
  Bottom 0.406: X10.3 IC2.2
N$82
  Bottom 0.406: X10.4 IC2.3
N$83
  Bottom 0.406: X10.5 IC2.4
N$84
  Bottom 0.406: X10.6 IC2.5
N$85
  Bottom 0.406: X10.7 IC2.6
N$86
  Bottom 0.406: X10.8 IC2.7
N$99  (1 unrouted)
  Top 0.254: 85.59,32.25 84.95,32.25 | 85.59,32.25 85.59,31.61 | 85.59,32.25 85.59,32.88 | 85.59,32.25 86.22,32.25 | 85.59,27.8 85.59,26.54
PWM
  Top 1.27: T2.1 71.62,66.54 R1.2
  Bottom 1.27: C6.1 X1.1 80.59,22.09 81.78,22.09 84.95,25.27 84.95,54.48 79.24,60.19 R1.2
PWM_SIGNAL
  Top 0.406: IC1.15 R2.2
RESET
  Bottom 0.406: R11.1 37.33,44.95 38.6,46.22 38.6,50.03 40.51,51.94 74.8,51.94 79.24,47.49 81.78,47.49 SV9.3
RX
  Bottom 0.406: IC1.2 34.79,50.03 39.23,54.48 50.66,54.48 51.3,55.11 51.3,57.65 56.38,62.73 X2.2
SCK
  Top 0.406: IC1.19 55.11,55.11 58.28,51.94 77.33,51.94 79.24,50.03 81.78,50.03 SV9.5
SHFT_CK
  Top 0.406: IC4.11 22.09,66.54 18.28,62.73 18.28,53.84 19.55,52.57 IC6.11 19.55,48.76 18.28,47.49 18.28,34.79 17.01,33.52 IC2.11 23.36,25.9 23.36,17.01 24.63,15.74 IC3.11 | IC5.11 46.22,25.9 46.22,17.01 47.49,15.74 IC7.11 | IC8.11 69.08,25.9 69.08,17.01 70.35,15.74 IC9.11
  Bottom 0.305: 32.25,62.73 R4.2
  Bottom 0.406: 32.25,62.73 29.07,65.91 22.73,65.91 22.09,66.54 IC4.11 | IC3.11 24.63,15.74 25.27,16.38 32.88,16.38 33.52,17.01 34.79,17.01 36.06,18.28 36.06,27.17 39.87,30.98 IC5.11 | IC7.11 47.49,15.74 48.12,16.38 55.74,16.38 56.38,17.01 57.02,17.01 58.92,18.28 58.92,27.17 62.73,30.98 IC8.11
SS
  Bottom 0.406: IC1.16 62.73,55.11 64,53.84 75.43,53.84 SV9.6
STATUS_LED
  Top 0.61: LED1.C IC1.14
TRIGGER
  Bottom 0.406: IC1.4 39.87,50.03 41.14,51.3 74.16,51.3 79.24,46.22 SV9.4
TX
  Bottom 0.406: IC1.3 37.33,50.03 39.87,52.57 51.3,52.57 53.84,55.11 53.84,57.65 58.92,62.73 X2.1
VCC
  Top 0.61: R10.1 65.27,37.33 71.62,37.33 76.78,32.17 X1.3
  Top 0.813: IC1.20 52.57,57.65 55.11,60.19 L1.1
  Top 1.27: IC3.16 11.93,11.93 13.2,10.66 29.71,10.66 33.52,14.47 IC7.16 34.79,11.93 36.06,10.66 52.57,10.66 56.38,14.47 IC9.16 57.65,13.2 60.19,10.66 75.43,10.66 77.33,12.56 77.33,16.38 C1.1 | IC1.20 52.57,55.11 47.49,50.03 IC1.7 47.49,37.33 50.03,34.79 IC8.16 | IC6.16 5.58,50.03 C8.1 2.41,32.88 3.04,32.25 IC2.16
  Bottom 0.813: X1.3 83.05,34.79 SV9.1 | L1.1 C16.1
  Bottom 1.27: IC4.16 9.39,63.37 4.95,58.92 4.95,51.94 IC6.16 | IC2.16 4.31,30.98 6.85,28.44 24,28.44 27.17,31.61 IC5.16 27.17,34.79 28.44,36.06 44.95,36.06 48.76,32.25 IC8.16 50.03,34.79 51.3,36.06 76.62,36.06 X1.3 80.43,32.25 79.24,32.25 72.89,25.9 R3.P$1 72.89,20.82 C1.1 | C4.1 IC3.16
XTAL1
  Bottom 0.406: Q1.2 52.57,41.14 C3.2 IC1.9
XTAL2
  Bottom 0.406: Q1.1 55.11,41.14 C2.2 IC1.10

### Text on the board
Top: T R G | UHF Indication Board v1.1 | (c) Wolfman | PWM